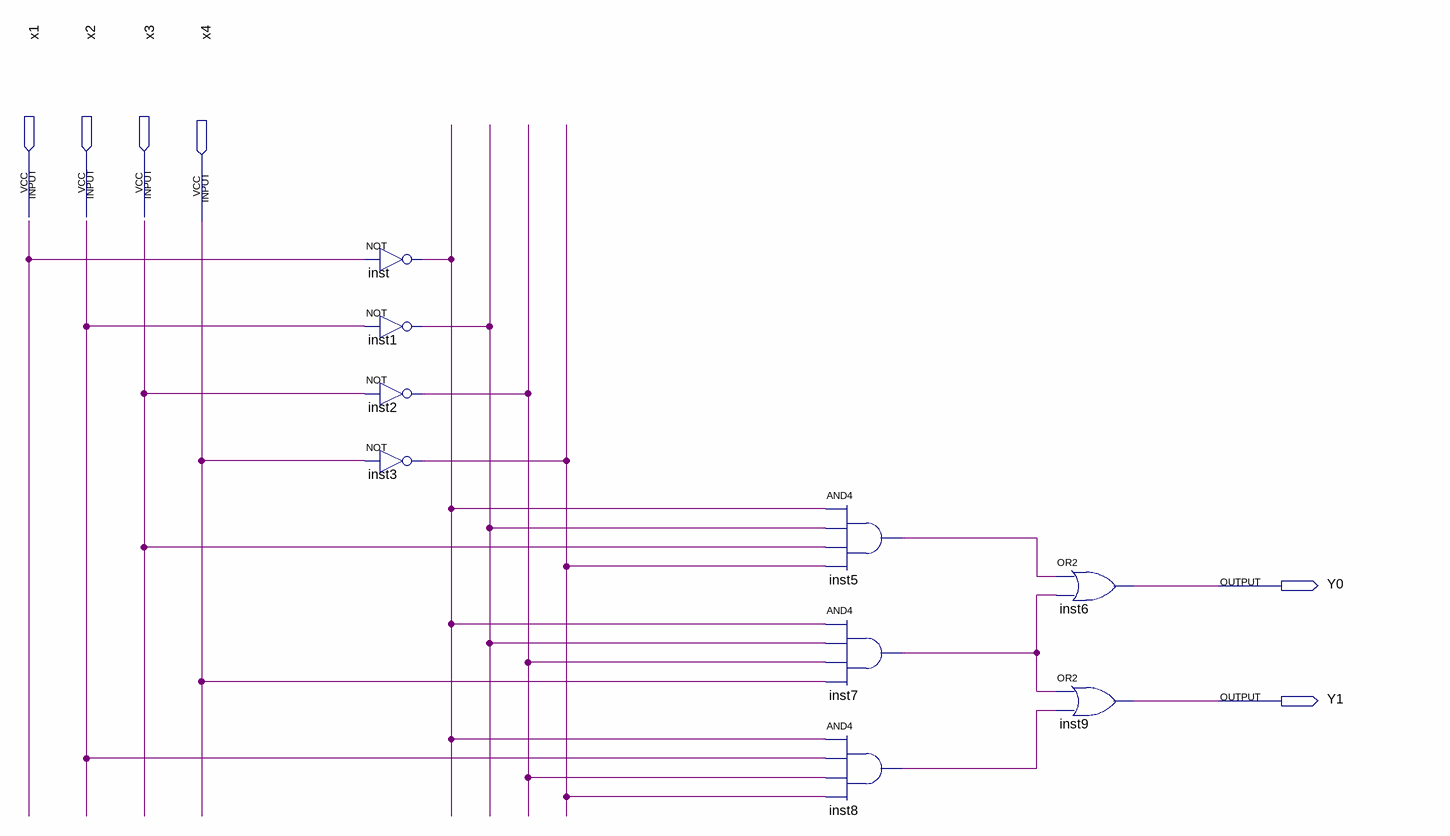
[diagram p0: schematic sheet]
// Quartus schematic pract3.bdf as structural Verilog: 9 symbols, 6 pins
module pract3 (
  input  x1,
  input  x2,
  input  x3,
  input  x4,
  output Y0,
  output Y1
);

  wire inst1_out, inst2_out, inst3_out, inst5_out, inst7_out, inst8_out, inst_out;

  not inst (inst_out, x1);
  not inst1 (inst1_out, x2);
  not inst2 (inst2_out, x3);
  not inst3 (inst3_out, x4);
  and inst5 (inst5_out, inst_out, inst1_out, x3, inst3_out);
  and inst7 (inst7_out, inst_out, inst1_out, inst2_out, x4);
  and inst8 (inst8_out, inst_out, x2, inst2_out, inst3_out);
  or inst6 (Y0, inst5_out, inst7_out);
  or inst9 (Y1, inst7_out, inst8_out);
endmodule
